# EAGLE schematic remote_control (EAGLE 6.6.0)
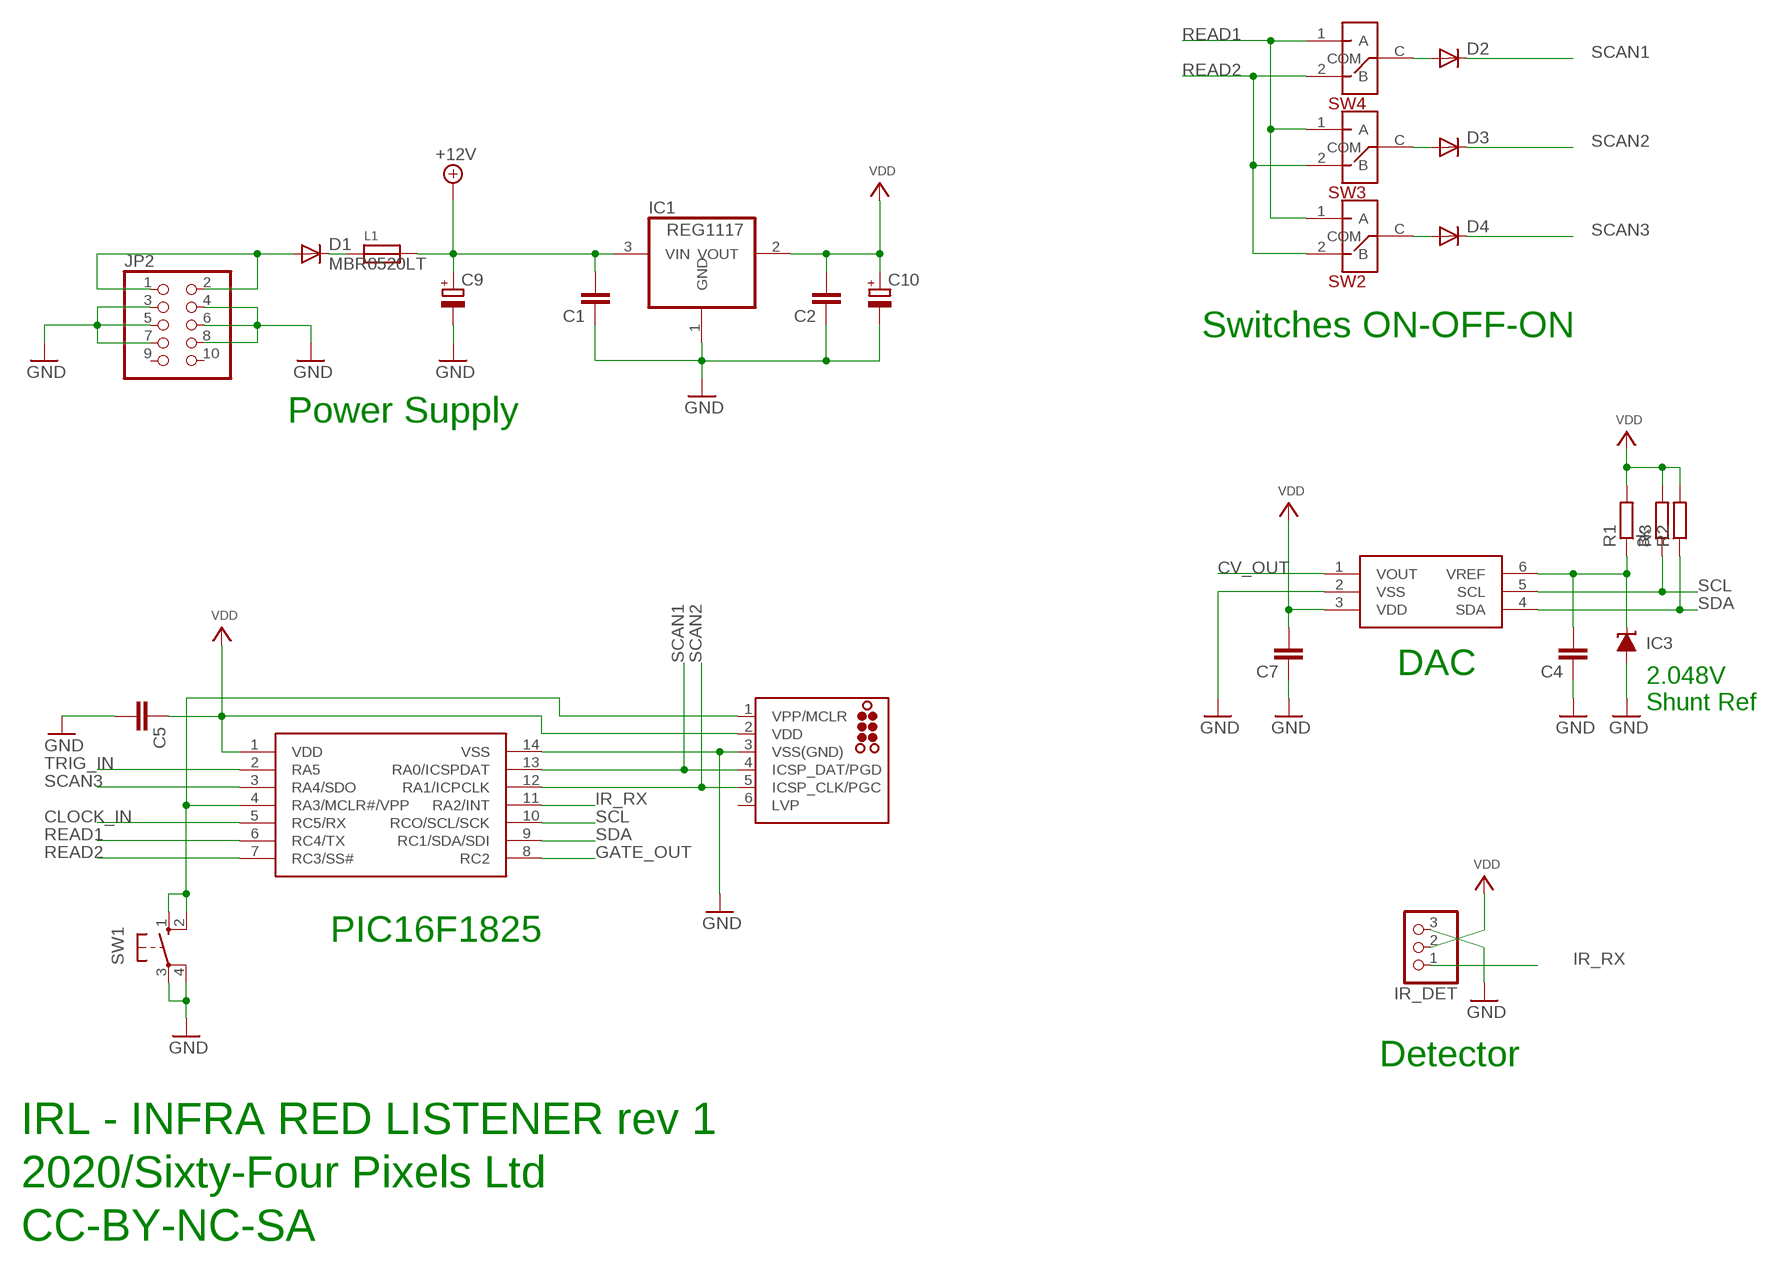
[diagram p0: schematic, sheet 1, part 1 of 2]
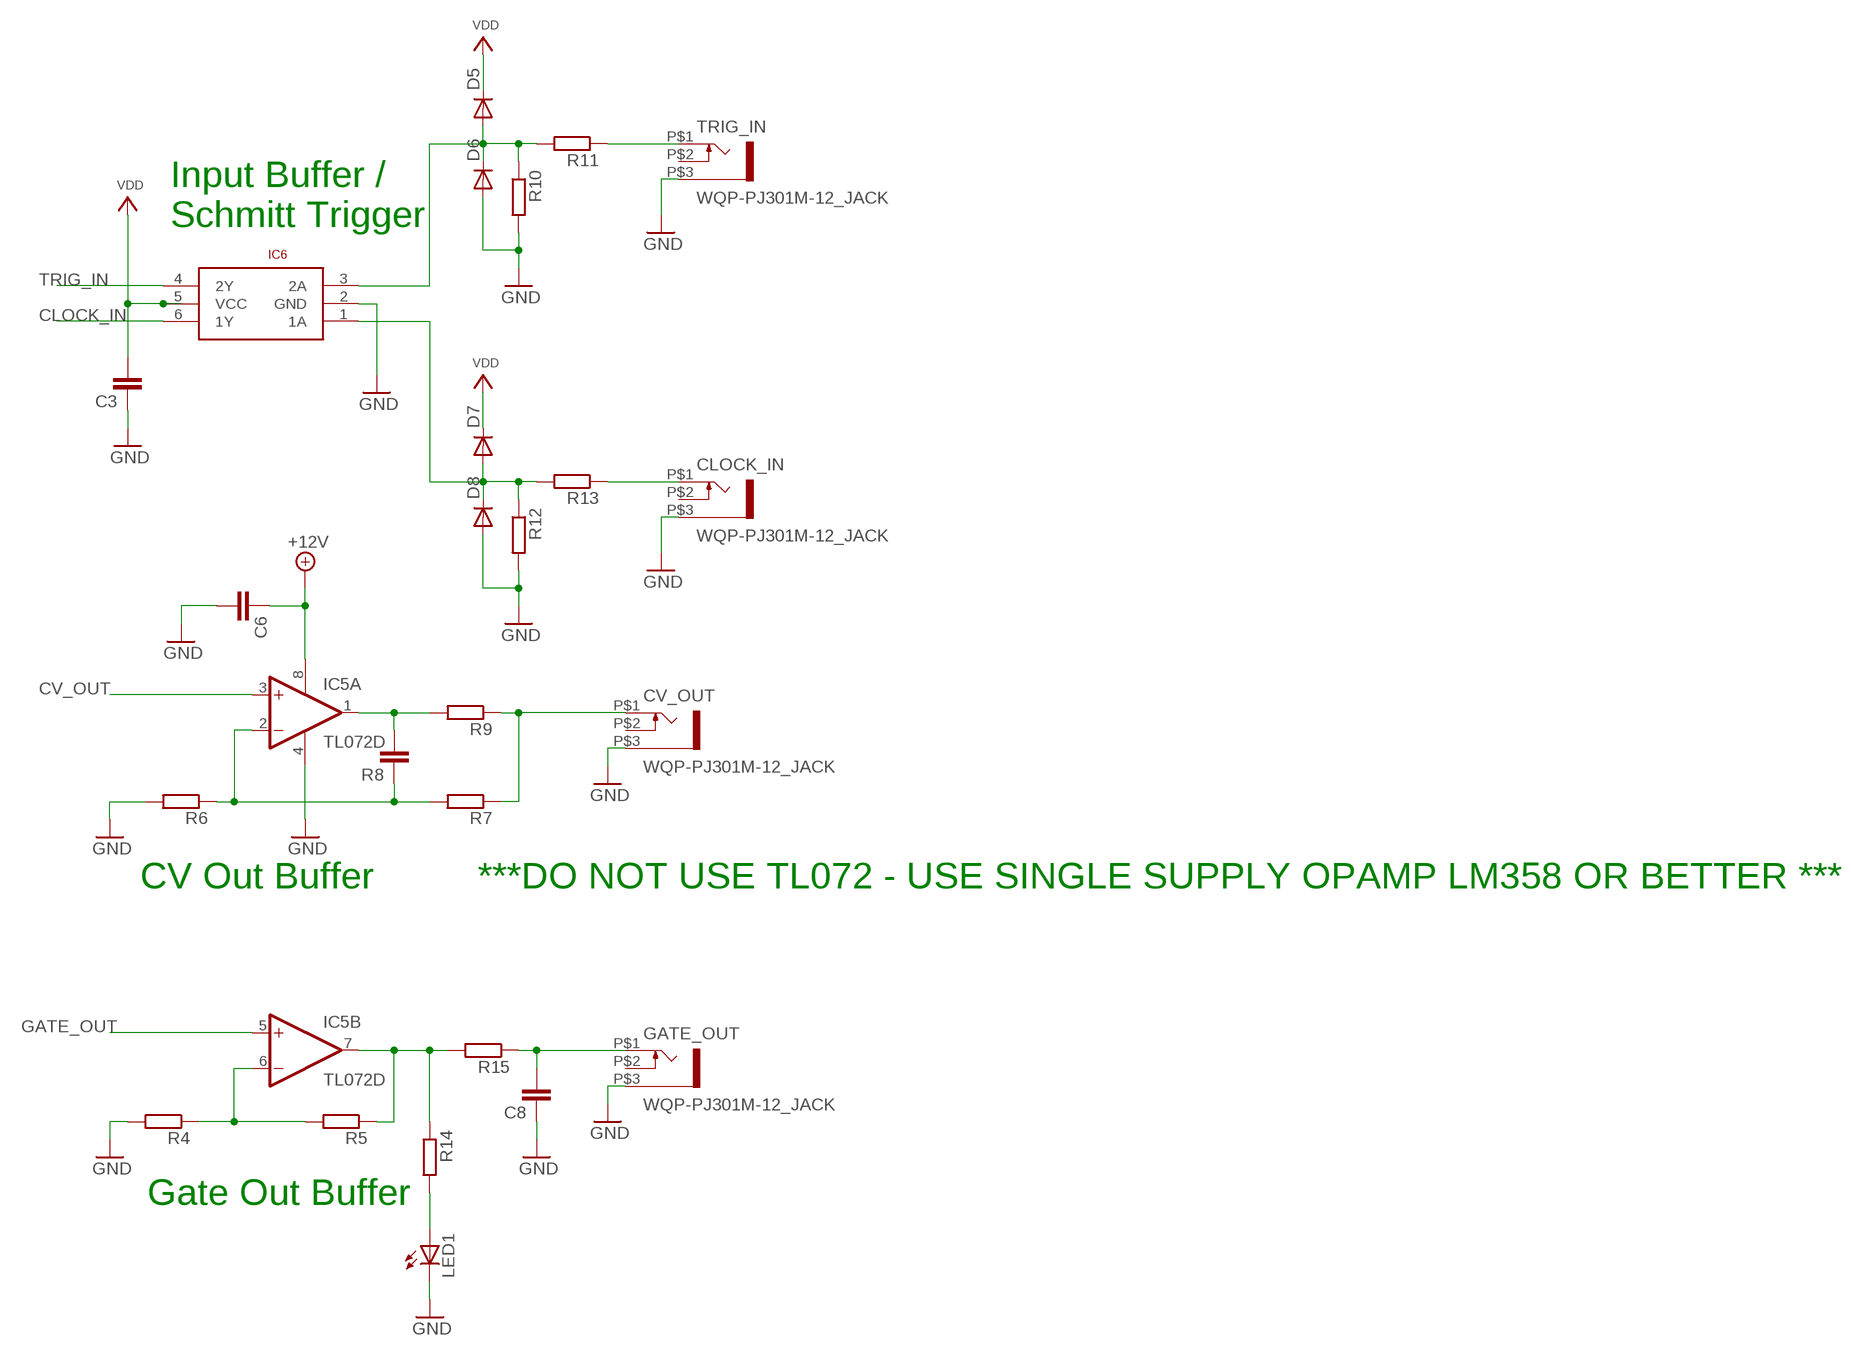
[diagram p1: schematic, sheet 1, part 2 of 2]

## Parts
C1  C-EUC0805  [C0805]
C2  C-EUC0805  [C0805]
C3  C-EUC0805  [C0805]
C4  C-EUC0805  [C0805]
C5  C-EUC0805  [C0805]
C6  C-EUC0805  [C0805]
C7  C-EUC0805  [C0805]
C8  C-EUC0805  [C0805]
C9  CPOL-EUE2-5  [E2-5]
C10  CPOL-EUE2-5  [E2-5]
CLOCK_IN  WQP-PJ301M-12_JACK  [WQP-PJ301M-12_JACK]
CV_OUT  WQP-PJ301M-12_JACK  [WQP-PJ301M-12_JACK]
D1  MBR0520LT  [SOD123]
D2  TS4148  [D0805]
D3  TS4148  [D0805]
D4  TS4148  [D0805]
D5  TS4148  [D0805]
D6  TS4148  [D0805]
D7  TS4148  [D0805]
D8  TS4148  [D0805]
GATE_OUT  WQP-PJ301M-12_JACK  [WQP-PJ301M-12_JACK]
IC1  REG1117  [SOT223]
IC2  PIC16F1825SO14  [SO14]
IC3  LM4041A12DBZ  [DBZ_R-PDSO-G3]
IC4  MCP4726  [SOT23-6]
IC5  TL072D  [SO08]
IC6  SN74LVC2G14  [DBV_R-PDSO-G6]
IR_DET  PINHD-1X3  [1X03]
J1  TC2030-MCP-NL  [TC2030-MCP-NL]
JP2  PINHD-2X5  [2X05]
L1  FERRITE  [0603]
LED1  LED3MM  [LED3MM]
R1  3k  R-EU_R0805  [R0805]
R2  R-EU_R0805  [R0805]
R3  R-EU_R0805  [R0805]
R4  R-EU_R0805  [R0805]
R5  R-EU_R0805  [R0805]
R6  R-EU_R0805  [R0805]
R7  R-EU_R0805  [R0805]
R8  C-EUC0805  [C0805]
R9  R-EU_R0805  [R0805]
R10  R-EU_R0805  [R0805]
R11  R-EU_R0805  [R0805]
R12  R-EU_R0805  [R0805]
R13  R-EU_R0805  [R0805]
R14  R-EU_R0805  [R0805]
R15  R-EU_R0805  [R0805]
SW1  10-XX  [B3F-10XX]
SW2  MICRO-SPDT  [MICRO-SPDT]
SW3  MICRO-SPDT  [MICRO-SPDT]
SW4  MICRO-SPDT  [MICRO-SPDT]
TRIG_IN  WQP-PJ301M-12_JACK  [WQP-PJ301M-12_JACK]

## Nets
+12V: C1.2 C6.1 C9.+ IC1.3(VIN) IC5.8(P:V+) L1.2
CLOCK_IN: IC2.5(RC5/RX) IC6.6(1Y)
CV_OUT: IC4.1(VOUT) IC5.3(A:+IN)
GATE_OUT: IC2.8(RC2) IC5.5(B:+IN)
GND: C1.1 C2.1 C3.1 C4.1 C5.2 C6.2 C7.1 C8.1 C9.- C10.- CLOCK_IN.P$3 CV_OUT.P$3 D6.A D8.A GATE_OUT.P$3 IC1.1(GND) IC2.14(VSS) IC3.2(A) IC4.2(VSS) IC5.4(P:V-) IC6.2(GND) IR_DET.3 J1.3(VSS(GND)) JP2.3 JP2.4 JP2.5 JP2.6 JP2.7 JP2.8 LED1.K(C) R4.2 R6.2 R10.2 R12.2 SW1.3(P) SW1.4(P1) TRIG_IN.P$3
IR_RX: IC2.11(RA2/INT) IR_DET.1
N$1: D1.A JP2.1 JP2.2
N$2: IC2.4(RA3/MCLR#/VPP) J1.1(VPP/MCLR) SW1.1(S) SW1.2(S1)
N$4: D1.C L1.1
N$5: LED1.A R14.2
N$6: C4.2 IC3.1(C) IC4.6(VREF) R1.1
N$9: CLOCK_IN.P$1 R13.1
N$10: R11.1 TRIG_IN.P$1
N$11: D2.A SW4.C(COM)
N$13: IC5.7(B:OUT) R5.1 R14.1 R15.2
N$14: D7.A D8.K(C) IC6.1(1A) R12.1 R13.2
N$15: D3.A SW3.C(COM)
N$16: C8.2 GATE_OUT.P$1 R15.1
N$17: IC5.6(B:-IN) R4.1 R5.2
N$18: IC5.2(A:-IN) R6.1 R7.2 R8.1
N$19: CV_OUT.P$1 R7.1 R9.1
N$20: IC5.1(A:OUT) R8.2 R9.2
N$25: D4.A SW2.C(COM)
READ1: IC2.6(RC4/TX) SW2.1(A) SW3.1(A) SW4.1(A)
READ2: IC2.7(RC3/SS#) SW2.2(B) SW3.2(B) SW4.2(B)
SCAN1: D2.K(C) IC2.13(RA0/ICSPDAT) J1.4(ICSP_DAT/PGD)
SCAN2: D3.K(C) IC2.12(RA1/ICPCLK) J1.5(ICSP_CLK/PGC)
SCAN3: D4.K(C) IC2.3(RA4/SDO)
SCL: IC2.10(RCO/SCL/SCK) IC4.5(SCL) R3.1
SDA: IC2.9(RC1/SDA/SDI) IC4.4(SDA) R2.1
TRIG_IN: IC2.2(RA5) IC6.4(2Y)
VDD: C2.2 C3.2 C5.1 C7.2 C10.+ D5.K(C) D7.K(C) IC1.2(VOUT) IC2.1(VDD) IC4.3(VDD) IC6.5(VCC) IR_DET.2 J1.2(VDD) R1.2 R2.2 R3.2
X: D5.A D6.K(C) IC6.3(2A) R10.1 R11.2
Unconnected: CLOCK_IN.P$2 CV_OUT.P$2 GATE_OUT.P$2 J1.6(LVP) JP2.9 JP2.10 TRIG_IN.P$2

## Notes on the sheet
- Input Buffer /
  Schmitt Trigger
- Switches ON-OFF-ON
- Power Supply
- DAC
- 2.048V 
  Shunt Ref
- CV Out Buffer | ***DO NOT USE TL072 - USE SINGLE SUPPLY OPAMP LM358 OR BETTER ***
- PIC16F1825
- Detector | Gate Out Buffer
- IRL - INFRA RED LISTENER rev 1
- 2020/Sixty-Four Pixels Ltd
- CC-BY-NC-SA

## Library data of the parts
C1-C8 R8 = resistor:C-EU: CAPACITOR, European symbol
C9 C10 = resistor:CPOL-EU: POLARIZED CAPACITOR, European symbol
CLOCK_IN CV_OUT GATE_OUT TRIG_IN = thonkiconn:WQP-PJ301M-12_JACK
D1 = diode:MBR0520LT: SCHOTTKY BARRIER RECTIFIER Source: http://onsemi.com .. MBR0520LT1-D.pdf
D2-D8 = jason_eagle6:TS4148
IC1 = burr-brown:REG1117: 800mA and 1A Low Dropout (LDO) Positive Regulator 1.8V, 2.5V, 2.85V, 3.3V, 5V, and Adj; MPN: REG1117; OC_FARNELL: 1097566; OC_NEWARK: 14P6981
IC2 = jasons_stuff:PIC16F1825
IC3 = texas:LM4041: PRECISION MICROPOWER SHUNT VOLTAGE REFERENCE Source: http://focus.ti.com/lit/ds/slcs146e/slcs146e.pdf; MPN: LM4041A12IDBZR; OC_FARNELL: 1407949; OC_NEWARK: 58K5875
IC4 = jasons_stuff:MCP4726: I2C DAC 12BIT
IC5 = linear:TL072: OP AMP
IC6 = jason_eagle6:SN74LVC2G14
IR_DET = pinhead:PINHD-1X3: PIN HEADER
J1 = tag-connect:TC2030: TAG-CONNECT ICSP Connector Manufacturer: Tag-Connect <http://www.tag-connect.com> Cable for easy In-Circuit Serial Programming. Designed for Microchip ICD2, suitable for many others. Two variants - one "with legs" (for hands-free fit on PCB) and another "without legs" for quick programming. PAD Description 1 MCLR/Vpp 2 Vdd 3 GND 4 PGD (ISPDAT) 5 PGC (ISPCLK) 6 nc (used for LVP) ©2009 ROFA.cz - modified and updated by Robert Darlington ‹rdarlington@gmail.com›
JP2 = pinhead:PINHD-2X5: PIN HEADER
L1 = microbuilder:FERRITE: Ferrite Bead 0603 MMZ1608B121C - 120 Ohm, 600mA Ferrite Chip - Digikey: 445-2164-1-ND BK1608HW121-T - 120 Ohm, 600mA Ferrite Chip - Digikey: 587-1876-2-ND
LED1 = led:LED: LED OSRAM: - CHIPLED LG R971, LG N971, LY N971, LG Q971, LY Q971, LO R971, LY R971 LH N974, LH R974 LS Q976, LO Q976, LY Q976 LO Q996 - Hyper CHIPLED LW Q18S LB Q993, LB Q99A, LB R99A - SideLED LS A670, LO A670, LY A670, LG A670, LP A670 LB A673, LV A673, LT A673, LW A673 LH A674 LY A675 LS A676, LA A676, LO A676, LY A676, LW A676 LS A679, LY A679, LG A679 - Hyper Micro SIDELED® LS Y876, LA Y876, LO Y876, LY Y876 LT Y87S - SmartLED LW L88C, LW L88S LB L89C, LB L89S, LG L890 LS L89K, LO L89K, LY L89K LS L896, LA L896, LO L896, LY L896 - TOPLED LS T670, LO T670, LY T670, LG T670, LP T670 LSG T670, LSP T670, LSY T670, LOP T670, LYG T670 LG T671, LOG T671, LSG T671 LB T673, LV T673, LT T673, LW T673 LH T674 LS T676, LA T676, LO T676, LY T676, LB T676, LH T676, LSB T676, LW T676 LB T67C, LV T67C, LT T67C, LS T67K, LO T67K, LY T67K, LW E67C LS E67B, LA E67B, LO E67B, LY E67B, LB E67C, LV E67C, LT E67C LW T67C LS T679, LY T679, LG T679 LS T770, LO T770, LY T770, LG T770, LP T770 LB T773, LV T773, LT T773, LW T773 LH T774 LS E675, LA E675, LY E675, LS T675 LS T776, LA T776, LO T776, LY T776, LB T776 LHGB T686 LT T68C, LB T68C - Hyper Mini TOPLED® LB M676 - Mini TOPLED Santana® LG M470 LS M47K, LO M47K, LY M47K Source: http://www.osram.convergy.de LUXEON: - LUMILED® LXK2-PW12-R00, LXK2-PW12-S00, LXK2-PW14-U00, LXK2-PW14-V00 LXK2-PM12-R00, LXK2-PM12-S00, LXK2-PM14-U00 LXK2-PE12-Q00, LXK2-PE12-R00, LXK2-PE12-S00, LXK2-PE14-T00, LXK2-PE14-U00 LXK2-PB12-K00, LXK2-PB12-L00, LXK2-PB12-M00, LXK2-PB14-N00, LXK2-PB14-P00, LXK2-PB14-Q00 LXK2-PR12-L00, LXK2-PR12-M00, LXK2-PR14-Q00, LXK2-PR14-R00 LXK2-PD12-Q00, LXK2-PD12-R00, LXK2-PD12-S00 LXK2-PH12-R00, LXK2-PH12-S00 LXK2-PL12-P00, LXK2-PL12-Q00, LXK2-PL12-R00 Source: www.luxeon.com KINGBRIGHT: KA-3528ASYC Source: www.kingbright.com
R1-R7 R9-R15 = rcl:R-EU_: RESISTOR, European symbol
SW1 = switch-omron:10-XX: OMRON SWITCH; MPN: B3F-1000; OC_FARNELL: 176432; OC_NEWARK: 36M3542
SW2-SW4 = jason_eagle6:MICRO-SPDT